# Altium project Temperature_Sensor.PrjPcb
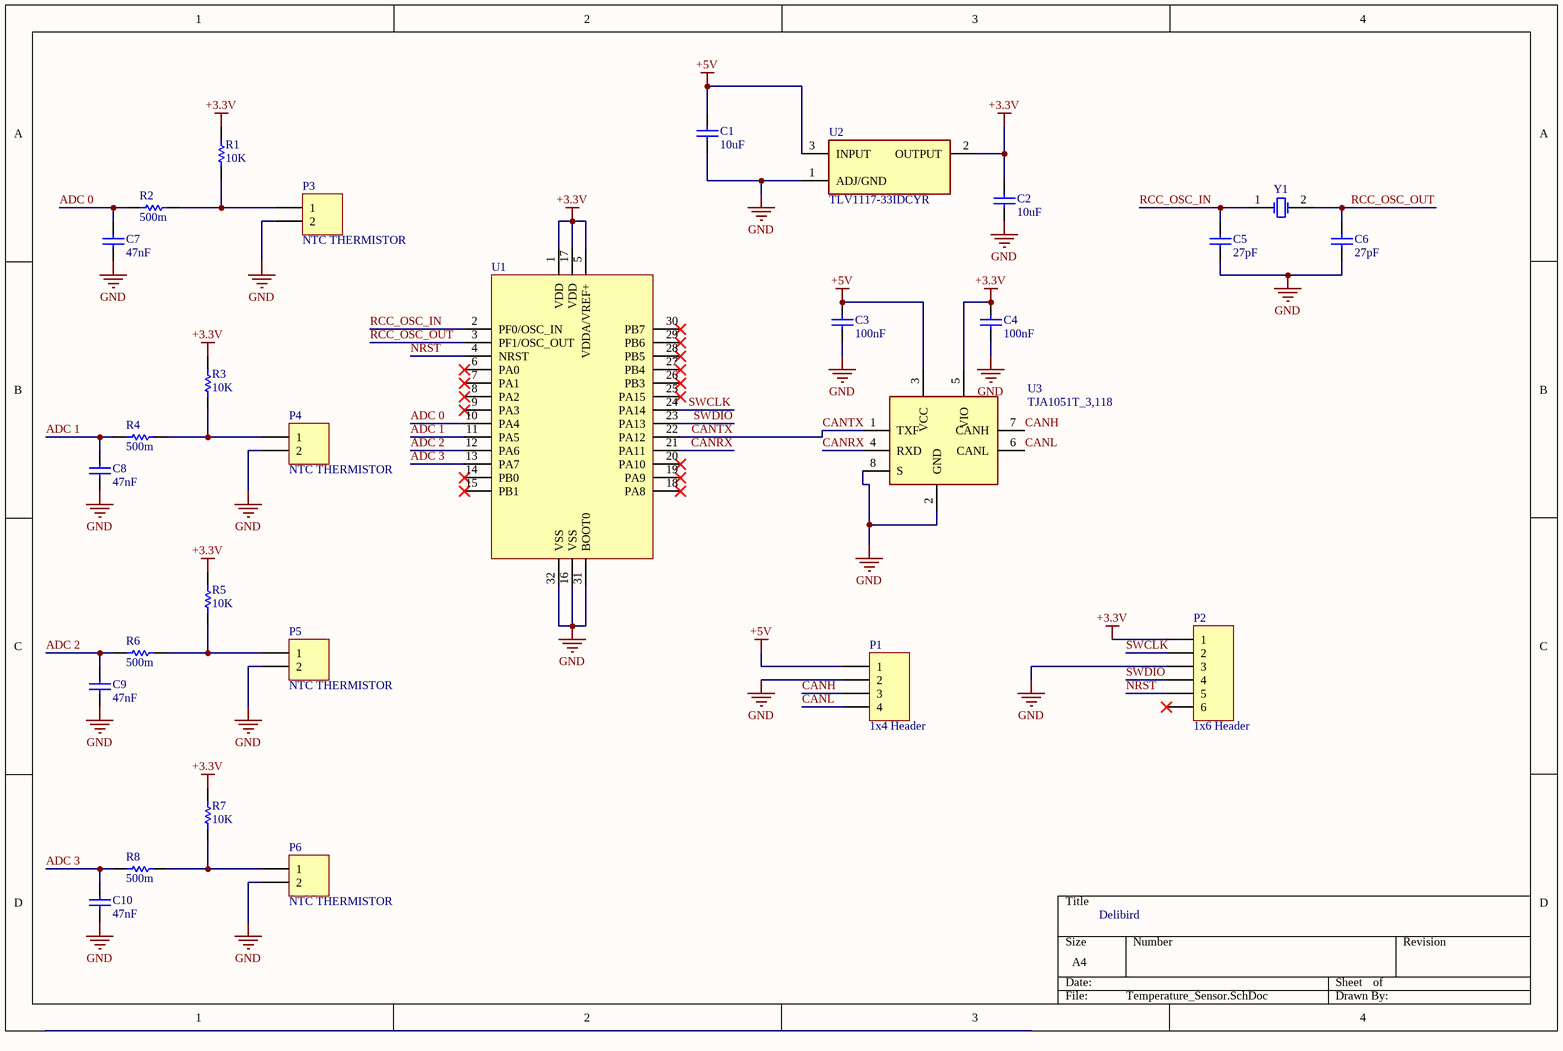
[diagram p0: Temperature_Sensor.SchDoc]
1 sheet, 28 parts. Net scope: global (net labels, ports and power ports of the same name join across sheets).
Board file: Temperature_Sensor.PcbDoc

## Sheet Temperature_Sensor.SchDoc
size A4

### Parts
C1  value 10uF  [0805 - Capacitor]  (hidden comment: Capacitor - Nonpolarized)
C2  value 10uF  [0805 - Capacitor]  (hidden comment: Capacitor - Nonpolarized)
C3  value 100nF  [0805 - Capacitor]  (hidden comment: Capacitor - Nonpolarized)
C4  value 100nF  [0805 - Capacitor]  (hidden comment: Capacitor - Nonpolarized)
C5  value 27pF  [0805 - Capacitor]  (hidden comment: Capacitor - Nonpolarized)
C6  value 27pF  [0805 - Capacitor]  (hidden comment: Capacitor - Nonpolarized)
C7  value 47nF  [0805 - Capacitor]  (hidden comment: Capacitor - Nonpolarized)
C8  value 47nF  [0805 - Capacitor]  (hidden comment: Capacitor - Nonpolarized)
C9  value 47nF  [0805 - Capacitor]  (hidden comment: Capacitor - Nonpolarized)
C10  value 47nF  [0805 - Capacitor]  (hidden comment: Capacitor - Nonpolarized)
P1  1x4 Header  [HDR1X4]
P2  1x6 Header  [HDR1X6]
P3  NTC THERMISTOR  [HDR1X2]
P4  NTC THERMISTOR  [HDR1X2]
P5  NTC THERMISTOR  [HDR1X2]
P6  NTC THERMISTOR  [HDR1X2]
R1  value 10K  [0603 - Resistor]  (hidden comment: Resistor)
R2  value 500m  [0603 - Resistor]  (hidden comment: Resistor)
R3  value 10K  [0603 - Resistor]  (hidden comment: Resistor)
R4  value 500m  [0603 - Resistor]  (hidden comment: Resistor)
R5  value 10K  [0603 - Resistor]  (hidden comment: Resistor)
R6  value 500m  [0603 - Resistor]  (hidden comment: Resistor)
R7  value 10K  [0603 - Resistor]  (hidden comment: Resistor)
R8  value 500m  [0603 - Resistor]  (hidden comment: Resistor)
U1  STM32F303K6T6  [QFP80P900X900X160-32N]  (value not drawn)
U2  TLV1117-33IDCYR  [TLV1117]
U3  TJA1051T_3,118  [TJA1051T/3,118]
Y1  Oscillator  [2-SMD NO LEAD CRSYSTAL]  (value not drawn)

### Nets
+3.3V: C2.2 C4.2 P2.1 R1.2 R3.2 R5.2 R7.2 U1.1(VDD) U1.5(VDDA/VREF+) U1.17(VDD) U2.2(OUTPUT) U3.5(VIO)
+5V: C1.2 C3.2 P1.1 U2.3(INPUT) U3.3(VCC)
GND: C1.1 C2.1 C3.1 C4.1 C5.2 C6.2 C7.1 C8.1 C9.1 C10.1 P1.2 P2.3 P3.2 P4.2 P5.2 P6.2 U1.16(VSS) U1.31(BOOT0) U1.32(VSS) U2.1(ADJ/GND) U3.2(GND) U3.8(S)
ADC 0: C7.2 R2.2 U1.10(PA4)
ADC 1: C8.2 R4.2 U1.11(PA5)
ADC 2: C9.2 R6.2 U1.12(PA6)
ADC 3: C10.2 R8.2 U1.13(PA7)
CANH: P1.3 U3.7(CANH)
CANL: P1.4 U3.6(CANL)
CANRX: U1.21(PA11) U3.4(RXD)
CANTX: U1.22(PA12) U3.1(TXF)
NRST: P2.5 U1.4(NRST)
RCC_OSC_IN: C5.1 U1.2(PF0/OSC_IN) Y1.1(OSC1)
RCC_OSC_OUT: C6.1 U1.3(PF1/OSC_OUT) Y1.2(OSC2)
SWCLK: P2.2 U1.24(PA14)
SWDIO: P2.4 U1.23(PA13)
NetP3_1: P3.1 R1.1 R2.1
NetP4_1: P4.1 R3.1 R4.1
NetP5_1: P5.1 R5.1 R6.1
NetP6_1: P6.1 R7.1 R8.1

Not connected (* = marked no-connect by the designer): P2 6*; U1 6(PA0)* 7(PA1)* 8(PA2)* 9(PA3)* 14(PB0)* 15(PB1)* 18(PA8)* 19(PA9)* 20(PA10)* 25(PA15)* 26(PB3)* 27(PB4)* 28(PB5)* 29(PB6)* 30(PB7)*

### Notes on the sheet
- Delibird

### Library data of the parts
C1-C10 = Capacitor - Nonpolarized: Nonpolarized Capacitor; Supplier Part Number: *; Supplier: *; Manufacturer: *; Rating: *; Manufacturer Part Number: *
P1 = 1x4 Header: 1x4 Pin Header
P2 = 1x6 Header: 1x6 Pin Header
P3-P6 = 1x2 Header: 1x2 Pin Header
U1 = STM32F303K6T6: Integrated Circuit
U2 = TLV1117-33IDCYR: Linear Voltage Regulator IC 3.3V 800MA SOT223-4; Manufacturer: Texas Instruments; Datasheet: http://www.ti.com/lit/ds/symlink/tlv1117.pdf?HQS=TI-null-null-digikeymode-df-pf-null-wwe&ts=1590668900314; Manufacturer Part Number: TLV1117-33IDCYR; Supplier Part Number: 296-21112-1-ND; Supplier: Digikey
U3 = TJA1051T_3,118: CAN Transceiver IC 4.5V-5.5V 250ns; Manufacturer: NXP; Datasheet: http://www.nxp.com/docs/en/data-sheet/TJA1051.pdf; Manufacturer Part Number: TJA1051T/3,118; Supplier Part Number: 568-8684-1-ND; Supplier: Digikey
Y1 = Oscillator: Crystal Oscillator; Manufacturer Part Number: *; Manufacturer: *; Supplier Part Number: *; Supplier: *; Rating: *
R1-R8 = Resistor: Rating: *; Manufacturer Part Number: *; Manufacturer: *; Supplier Part Number: *; Supplier: *